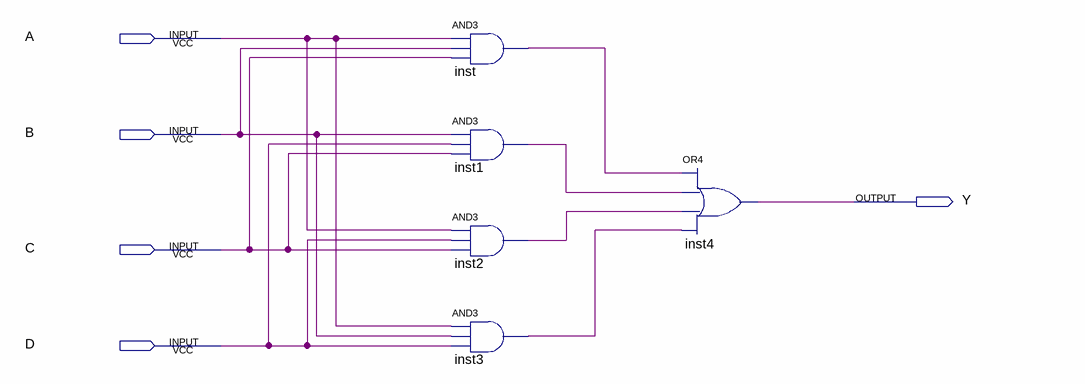
[diagram p0: schematic sheet]
// Quartus schematic a.bdf as structural Verilog: 5 symbols, 5 pins
module a (
  input  A,
  input  B,
  input  C,
  input  D,
  output Y
);

  wire inst1_out, inst2_out, inst3_out, inst_out;

  and inst (inst_out, A, B, C);
  and inst1 (inst1_out, B, D, C);
  and inst2 (inst2_out, A, D, C);
  and inst3 (inst3_out, A, B, D);
  or inst4 (Y, inst_out, inst1_out, inst2_out, inst3_out);
endmodule
